# EAGLE design MainBoard (EAGLE 9.6.2)
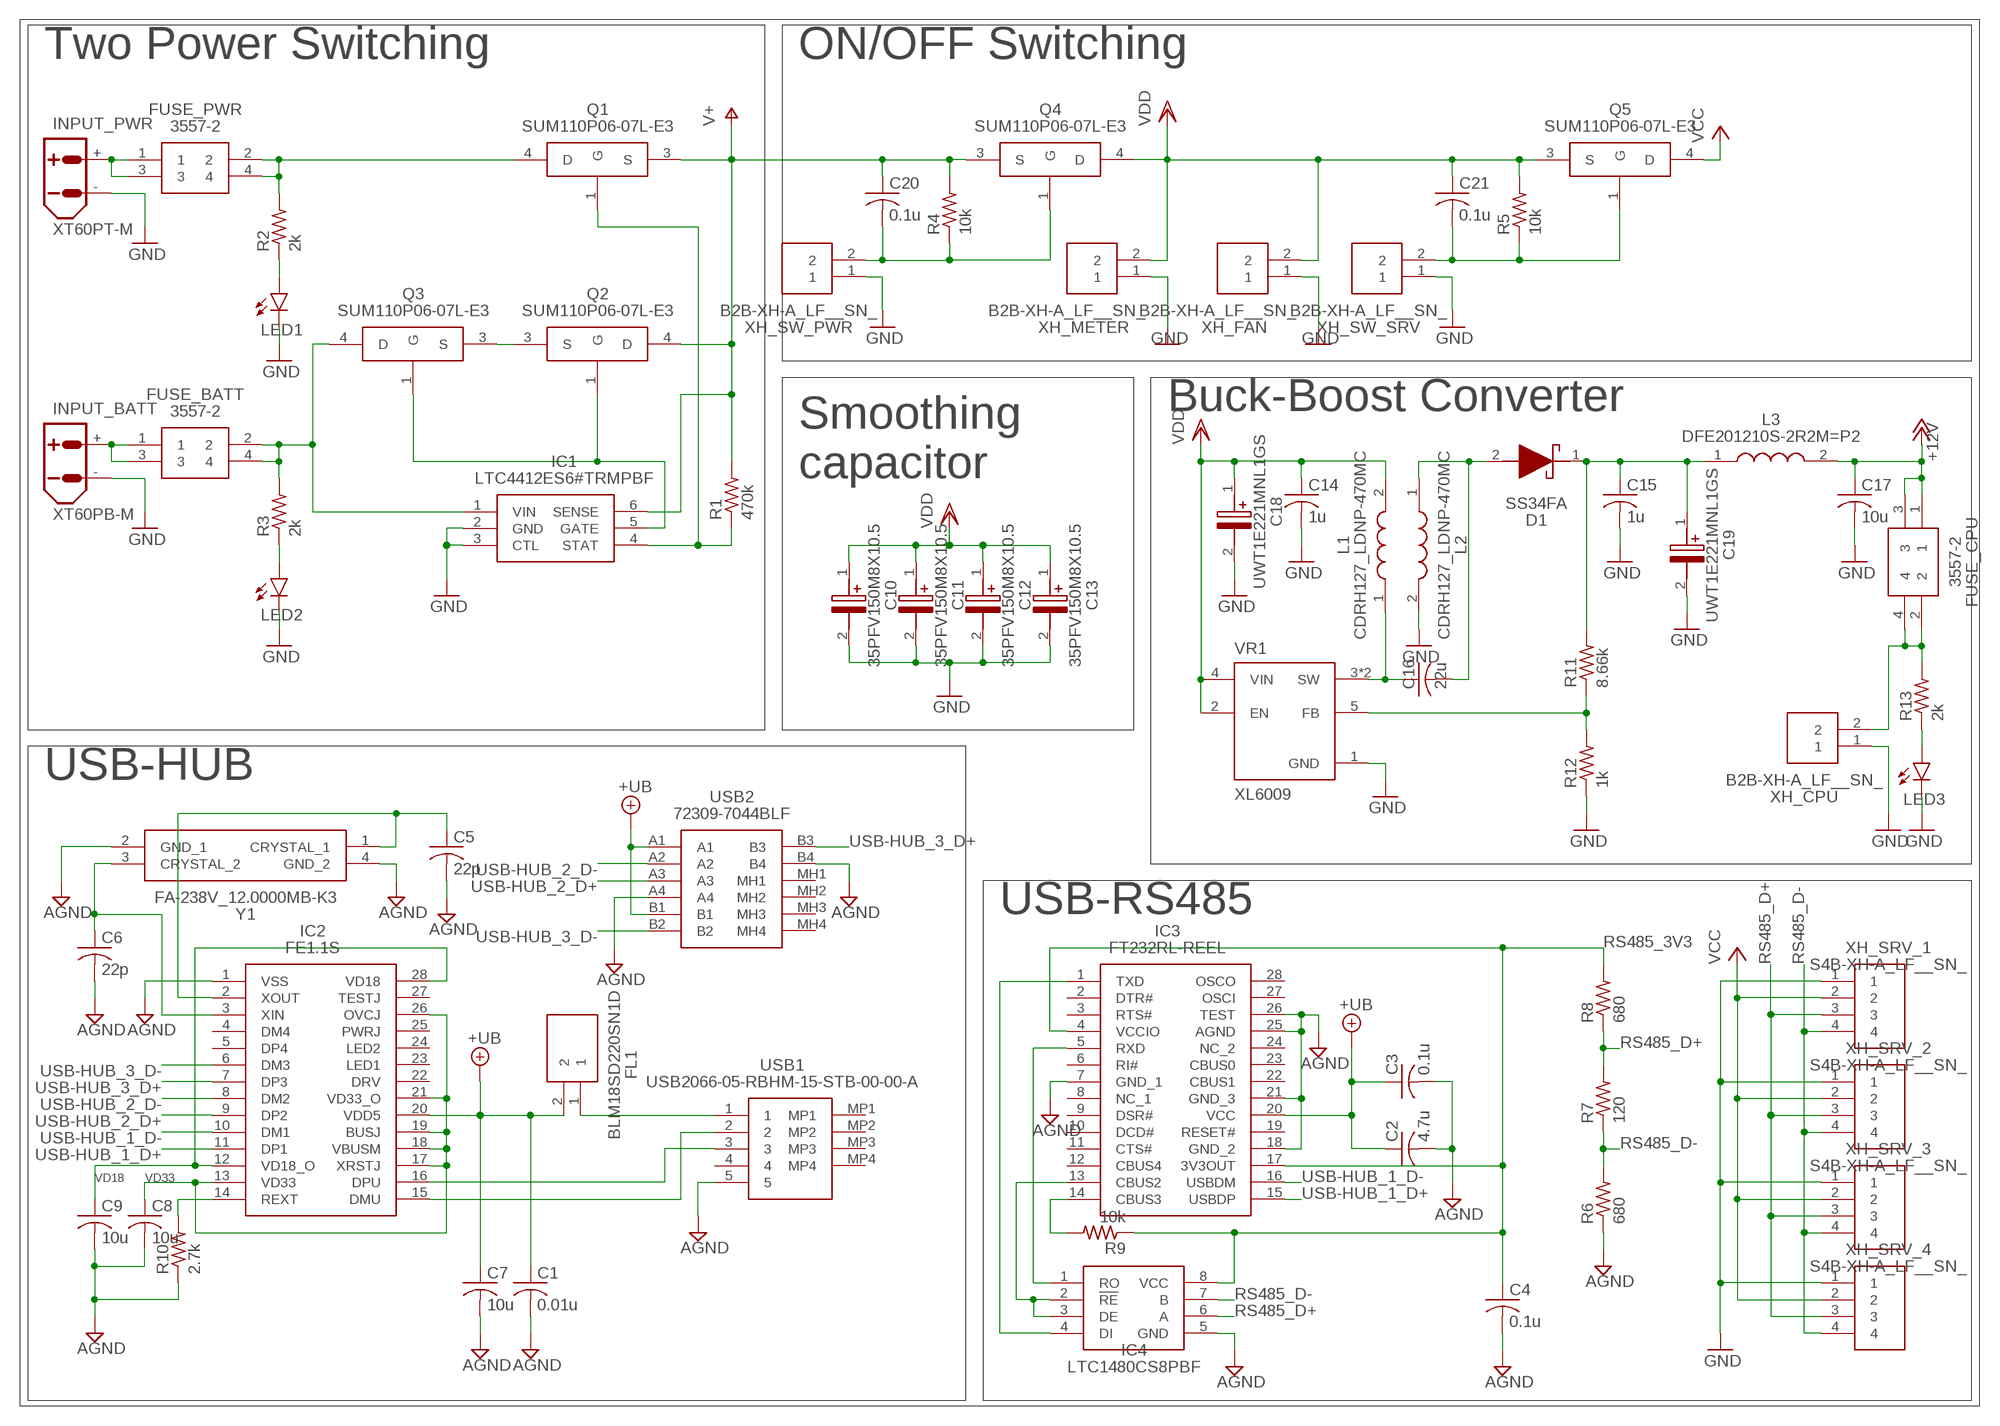
[diagram p0: schematic, sheet 1]

## Parts
C1  0.01u  C-USC1608  [C1608]
C2  4.7u  C-USC1608  [C1608]
C3  0.1u  C-USC1608  [C1608]
C4  0.1u  C-USC1608  [C1608]
C5  22p  C-USC1608  [C1608]
C6  22p  C-USC1608  [C1608]
C7  10u  C-USC1608  [C1608]
C8  10u  C-USC1608  [C1608]
C9  10u  C-USC1608  [C1608]
C10  35PFV150M8X10.5  [CAPAE830X1050N]
C11  35PFV150M8X10.5  [CAPAE830X1050N]
C12  35PFV150M8X10.5  [CAPAE830X1050N]
C13  35PFV150M8X10.5  [CAPAE830X1050N]
C14  1u  C-USC1608  [C1608]
C15  1u  C-USC1608  [C1608]
C16  22u  C-USC2012  [C2012]
C17  10u  C-USC1608  [C1608]
C18  UWT1E221MNL1GS  [CAPAE830X1080N]
C19  UWT1E221MNL1GS  [CAPAE830X1080N]
C20  0.1u  C-USC1608  [C1608]
C21  0.1u  C-USC1608  [C1608]
D1  SS34FA  [SODFL3618X143N]
FL1  BLM18SD220SN1D  [BLM18AG102BH1D]
FUSE_BATT  3557-2  [3557-2]
FUSE_CPU  3557-2  [3557-2]
FUSE_PWR  3557-2  [3557-2]
IC1  LTC4412ES6#TRMPBF  [SOT95P280X100-6N]
IC2  FE1.1S  [SOP64P600X175-28N]
IC3  FT232RL-REEL  [SOP65P778X200-28N]
IC4  LTC1480CS8PBF  [SOIC127P599X175-8N]
INPUT_BATT  XT60PB-M  [XT60PB-M]
INPUT_PWR  XT60PT-M  [XT60PT-M]
L1  CDRH127_LDNP-470MC  [INDPM120120X800N]
L2  CDRH127_LDNP-470MC  [INDPM120120X800N]
L3  DFE201210S-2R2M=P2  [DFE201210S1R0MP2]
LED1  LEDSML0603  [SML0603]
LED2  LEDSML0603  [SML0603]
LED3  LEDSML0603  [SML0603]
Q1  SUM110P06-07L-E3  [TO254P1524X483-4N]
Q2  SUM110P06-07L-E3  [TO254P1524X483-4N]
Q3  SUM110P06-07L-E3  [TO254P1524X483-4N]
Q4  SUM110P06-07L-E3  [TO254P1524X483-4N]
Q5  SUM110P06-07L-E3  [TO254P1524X483-4N]
R1  470k  R-US_R0603  [R0603]
R2  2k  R-US_R0603  [R0603]
R3  2k  R-US_R0603  [R0603]
R4  10k  R-US_R0603  [R0603]
R5  10k  R-US_R0603  [R0603]
R6  680  R-US_R0603  [R0603]
R7  120  R-US_R0603  [R0603]
R8  680  R-US_R0603  [R0603]
R9  10k  R-US_R0603  [R0603]
R10  2.7k  R-US_R0603  [R0603]
R11  8.66k  R-US_R0603  [R0603]
R12  1k  R-US_R0603  [R0603]
R13  2k  R-US_R0603  [R0603]
USB1  USB2066-05-RBHM-15-STB-00-00-A  [USB206605RBHM15STB0000A]
USB2  72309-7044BLF  [723097044BLF]
VR1  XL6009  [DPAK170P1435X465-6N]
XH_CPU  B2B-XH-A_LF__SN_  [SHDR2W64P0X250_1X2_740X575X700]
XH_FAN  B2B-XH-A_LF__SN_  [SHDR2W64P0X250_1X2_740X575X700]
XH_METER  B2B-XH-A_LF__SN_  [SHDR2W64P0X250_1X2_740X575X700]
XH_SRV_1  S4B-XH-A_LF__SN_  [SHDRRA4W64P0X250_1X4_1240X1150]
XH_SRV_2  S4B-XH-A_LF__SN_  [SHDRRA4W64P0X250_1X4_1240X1150]
XH_SRV_3  S4B-XH-A_LF__SN_  [SHDRRA4W64P0X250_1X4_1240X1150]
XH_SRV_4  S4B-XH-A_LF__SN_  [SHDRRA4W64P0X250_1X4_1240X1150]
XH_SW_PWR  B2B-XH-A_LF__SN_  [SHDR2W64P0X250_1X2_740X575X700]
XH_SW_SRV  B2B-XH-A_LF__SN_  [SHDR2W64P0X250_1X2_740X575X700]
Y1  FA-238V_12.0000MB-K3  [FA238V120000MBK3]

## Nets
+12V [DCDC_POWER]: C17.1 FUSE_CPU.1 FUSE_CPU.3 L3.2
+UB [USB_POWER]: C1.1 C2.1 C3.1 C7.1 FL1.2 IC2.20(VDD5) IC3.20(VCC) USB2.A1 USB2.B1
AFTER_FUSE_BATT [VCC]: FUSE_BATT.2 FUSE_BATT.4 IC1.1(VIN) Q3.4(D) R3.2
AFTER_FUSE_CPU [DCDC_POWER]: FUSE_CPU.2 FUSE_CPU.4 R13.2 XH_CPU.2
AFTER_FUSE_PWR [VCC]: FUSE_PWR.2 FUSE_PWR.4 Q1.4(D) R2.2
AGND [USB_POWER]: C1.2 C2.2 C3.2 C4.2 C5.2 C6.2 C7.2 C8.2 C9.2 IC2.1(VSS) IC3.7(GND_1) IC3.18(GND_2) IC3.21(GND_3) IC3.25(AGND) IC3.26(TEST) IC4.5(GND) R6.1 R10.1 USB1.5 USB2.A4 USB2.B4 Y1.2(GND_1) Y1.4(GND_2)
BEFORE_FUSE_BATT [VCC]: FUSE_BATT.1 FUSE_BATT.3 INPUT_BATT.+
BEFORE_FUSE_PWR [VCC]: FUSE_PWR.1 FUSE_PWR.3 INPUT_PWR.+
DCDC_1 [DCDC_POWER]: C16.1 L1.1 VR1.3(SW) VR1.6(SW)
DCDC_2 [DCDC_POWER]: C16.2 D1.2(A) L2.1
DCDC_3 [DCDC_POWER]: C15.1 C19.1(+) D1.1(K) L3.1 R11.2
DCDC_4 [DCDC_POWER]: R11.1 R12.2 VR1.5(FB)
FET_S_S [VCC]: Q2.3(S) Q3.3(S)
GND [GND]: C10.2(-) C11.2(-) C12.2(-) C13.2(-) C14.2 C15.2 C17.2 C18.2(-) C19.2(-) IC1.2(GND) IC1.3(CTL) INPUT_BATT.- INPUT_PWR.- L2.2 LED1.C LED2.C LED3.C R12.1 VR1.1(GND) XH_CPU.1 XH_FAN.1 XH_METER.1 XH_SRV_1.1 XH_SRV_2.1 XH_SRV_3.1 XH_SRV_4.1 XH_SW_PWR.1 XH_SW_SRV.1
LED1: LED1.A R2.1
LED2: LED2.A R3.1
LED3: LED3.A R13.1
N$1 [POWER_SW]: IC1.5(GATE) Q2.1(G) Q3.1(G)
N$2 [POWER_SW]: C20.2 Q4.1(G) R4.1 XH_SW_PWR.2
N$11 [POWER_SW]: C21.2 Q5.1(G) R5.1 XH_SW_SRV.2
N$21 [USB_SIGNAL]: C5.1 IC2.2(XOUT) Y1.1(CRYSTAL_1)
N$22 [USB_POWER]: FL1.1 USB1.1
N$23 [USB_SIGNAL]: C6.1 IC2.3(XIN) Y1.3(CRYSTAL_2)
N$29 [USB_SIGNAL]: IC2.15(DMU) USB1.2
N$30 [USB_SIGNAL]: IC2.16(DPU) USB1.3
N$31 [USB_SIGNAL]: IC2.14(REXT) R10.2
POWER_SW1 [POWER_SW]: IC1.4(STAT) Q1.1(G) R1.1
RS485_1 [USB_SIGNAL]: IC3.14(CBUS3) R9.2
RS485_2 [USB_SIGNAL]: IC3.13(CBUS2) IC4.2(!RE) IC4.3(DE)
RS485_3V3 [USB_POWER]: C4.1 IC3.4(VCCIO) IC3.17(3V3OUT) IC4.8(VCC) R8.2 R9.1
RS485_D+ [USB_SIGNAL]: IC4.6(A) R7.2 R8.1 XH_SRV_1.3 XH_SRV_2.3 XH_SRV_3.3 XH_SRV_4.3
RS485_D- [USB_SIGNAL]: IC4.7(B) R6.2 R7.1 XH_SRV_1.4 XH_SRV_2.4 XH_SRV_3.4 XH_SRV_4.4
RXD [USB_SIGNAL]: IC3.5(RXD) IC4.1(RO)
TXD [USB_SIGNAL]: IC3.1(TXD) IC4.4(DI)
USB-HUB_1_D+ [USB_SIGNAL]: IC2.11(DP1) IC3.15(USBDP)
USB-HUB_1_D- [USB_SIGNAL]: IC2.10(DM1) IC3.16(USBDM)
USB-HUB_2_D+ [USB_SIGNAL]: IC2.9(DP2) USB2.A3
USB-HUB_2_D- [USB_SIGNAL]: IC2.8(DM2) USB2.A2
USB-HUB_3_D+ [USB_SIGNAL]: IC2.7(DP3) USB2.B3
USB-HUB_3_D- [USB_SIGNAL]: IC2.6(DM3) USB2.B2
V+ [VCC]: C20.1 IC1.6(SENSE) Q1.3(S) Q2.4(D) Q4.3(S) R1.2 R4.2
VCC [VCC]: Q5.4(D) XH_SRV_1.2 XH_SRV_2.2 XH_SRV_3.2 XH_SRV_4.2
VD18 [USB_POWER]: C9.1 IC2.12(VD18_O) IC2.28(VD18)
VD33 [USB_POWER]: C8.1 IC2.13(VD33) IC2.17(XRSTJ) IC2.18(VBUSM) IC2.19(BUSJ) IC2.21(VD33_O) IC2.26(OVCJ)
VDD [VCC]: C10.1(+) C11.1(+) C12.1(+) C13.1(+) C14.1 C18.1(+) C21.1 L1.2 Q4.4(D) Q5.3(S) R5.2 VR1.2(EN) VR1.4(VIN) XH_FAN.2 XH_METER.2
Unconnected: IC2.4(DM4) IC2.5(DP4) IC2.22(DRV) IC2.23(LED1) IC2.24(LED2) IC2.25(PWRJ) IC2.27(TESTJ) IC3.2(DTR#) IC3.3(RTS#) IC3.6(RI#) IC3.8(NC_1) IC3.9(DSR#) IC3.10(DCD#) IC3.11(CTS#) IC3.12(CBUS4) IC3.19(RESET#) IC3.22(CBUS1) IC3.23(CBUS0) IC3.24(NC_2) IC3.27(OSCI) IC3.28(OSCO) USB1.4 USB1.MP1 USB1.MP2 USB1.MP3 USB1.MP4 USB2.MH1 USB2.MH2 USB2.MH3 USB2.MH4

## Notes on the sheet
- Two Power Switching | ON/OFF Switching
- Buck-Boost Converter
- Smoothing
  capacitor
- USB-HUB
- USB-RS485

## Library data of the parts
C1-C9 C14-C17 C20 C21 = rcl:C-US: CAPACITOR, American symbol; SPICEPREFIX: C
C10-C13 = SamacSys_Parts:35PFV150M8X10.5: Aluminium Organic Polymer Capacitors HIGH TEMP HYBRID CAPACITOR Source: Datasheet <https://www.mouser.jp/datasheet/2/977/e_PFV-1600672.pdf>; DESCRIPTION: Aluminium Organic Polymer Capacitors HIGH TEMP HYBRID CAPACITOR; HEIGHT: 10.5mm; MANUFACTURER_NAME: Rubycon; MANUFACTURER_PART_NUMBER: 35PFV150M8X10.5; MOUSER_PART_NUMBER: 232-35PFV150M8X10.5; MOUSER_PRICE-STOCK: https://www.mouser.co.uk/ProductDetail/Rubycon/35PFV150M8X105?qs=T3oQrply3y9NUlhGsXy%252Bsg%3D%3D
C18 C19 = SamacSys_Parts:UWT1E221MNL1GS: NICHICON - UWT1E221MNL1GS - ALUMINUM ELECTROLYTIC CAPACITOR 220UF 25V 20%, SMD Source: Datasheet <http://www.nichicon.co.jp/english/products/pdfs/e-uwt.pdf>; DESCRIPTION: NICHICON - UWT1E221MNL1GS - ALUMINUM ELECTROLYTIC CAPACITOR 220UF 25V 20%, SMD; HEIGHT: 10.8mm; MANUFACTURER_NAME: Nichicon; MANUFACTURER_PART_NUMBER: UWT1E221MNL1GS; MOUSER_PART_NUMBER: 647-UWT1E221MNL1GS; MOUSER_PRICE-STOCK: https://www.mouser.co.uk/ProductDetail/Nichicon/UWT1E221MNL1GS?qs=9nXXK2icEIxMJgFBHlqiZQ%3D%3D
D1 = SamacSys_Parts:SS34FA: ON SEMICONDUCTOR - SS34FA - SCHOTTKY RECT, AEC-Q101, 40V, SOD-123FA Source: Datasheet <http://www.onsemi.com/pub/Collateral/SS36FA-D.pdf>; DESCRIPTION: ON SEMICONDUCTOR - SS34FA - SCHOTTKY RECT, AEC-Q101, 40V, SOD-123FA; HEIGHT: 1.43mm; MANUFACTURER_NAME: ON Semiconductor; MANUFACTURER_PART_NUMBER: SS34FA; MOUSER_PART_NUMBER: 512-SS34FA; MOUSER_PRICE-STOCK: https://www.mouser.co.uk/ProductDetail/ON-Semiconductor-Fairchild/SS34FA?qs=R26iFe%2FkX%2FK1QUwZdCmBBw%3D%3D
FL1 = SamacSys_Parts:BLM18SD220SN1D: BLM18_N1D Series EMI Suppression Filter 22+/-25% at 100MHz 6A @85 Source: Datasheet <https://componentsearchengine.com/Datasheets/1/BLM18SD220SN1D.pdf>; DESCRIPTION: BLM18_N1D Series EMI Suppression Filter 22+/-25% at 100MHz 6A @85; HEIGHT: 0.95mm; MANUFACTURER_NAME: Murata Electronics; MANUFACTURER_PART_NUMBER: BLM18SD220SN1D; MOUSER_PART_NUMBER: 81-BLM18SD220SN1D; MOUSER_PRICE-STOCK: https://www.mouser.com/Search/Refine.aspx?Keyword=81-BLM18SD220SN1D
FUSE_BATT FUSE_CPU FUSE_PWR = SamacSys_Parts:3557-2: THM 2 in 1 Auto Blade Holder P/N 3557-2 Source: Datasheet <http://www.keyelco.com/product-pdf.cfm?p=296>; DESCRIPTION: THM 2 in 1 Auto Blade Holder P/N 3557-2; HEIGHT: mm; MANUFACTURER_NAME: Keystone Electronics; MANUFACTURER_PART_NUMBER: 3557-2; MOUSER_PART_NUMBER: 534-3557-2; MOUSER_PRICE-STOCK: https://www.mouser.co.uk/ProductDetail/Keystone-Electronics/3557-2?qs=cxy41lVAGV%2FfbyASjpXK1g%3D%3D
IC1 = SamacSys_Parts:LTC4412ES6#TRMPBF: Power Management Specialized - PMIC Automatic PowerPath Controller in ThinSOT Source: Datasheet; DESCRIPTION: Power Management Specialized - PMIC Automatic PowerPath Controller in ThinSOT; HEIGHT: 1mm; MANUFACTURER_NAME: Analog Devices; MANUFACTURER_PART_NUMBER: LTC4412ES6#TRMPBF; MOUSER_PART_NUMBER: 584-LTC4412ES6TRMPBF; MOUSER_PRICE-STOCK: https://www.mouser.co.uk/ProductDetail/Analog-Devices/LTC4412ES6TRMPBF?qs=hVkxg5c3xu8vBeVp9%252BXk%252Bg%3D%3D
IC2 = SamacSys_Parts:FE1.1S: USB 2.0 HIGH SPEED 4-PORT HUB CONTROLLER Source: Datasheet <https://cdn-shop.adafruit.com/product-files/2991/FE1.1s Data Sheet (Rev. 1.0).pdf>; DESCRIPTION: USB 2.0 HIGH SPEED 4-PORT HUB CONTROLLER; HEIGHT: 1.75mm; MANUFACTURER_NAME: JFD IC; MANUFACTURER_PART_NUMBER: FE1.1S
IC3 = SamacSys_Parts:FT232RL-REEL: USB/Serial IC UART SSOP-28 FTDI Chip FT232RL-REEL, USB Controller, 3MBd, USB 2.0, 1.8 5.25 V, 28-Pin SSOP Source: Datasheet <http://www.ftdichip.com/Support/Documents/DataSheets/ICs/DS_FT232R.pdf>; DESCRIPTION: USB/Serial IC UART SSOP-28 FTDI Chip FT232RL-REEL, USB Controller, 3MBd, USB 2.0, 1.8 5.25 V, 28-Pin SSOP; HEIGHT: 2mm; MANUFACTURER_NAME: FTDI Chip; MANUFACTURER_PART_NUMBER: FT232RL-REEL; MOUSER_PART_NUMBER: 895-FT232RL; MOUSER_PRICE-STOCK: https://www.mouser.co.uk/ProductDetail/FTDI/FT232RL-REEL?qs=D1%2FPMqvA103RC6OU6bKtoA%3D%3D
IC4 = SamacSys_Parts:LTC1480CS8PBF: 3.3V Ultralow Power RS485 Transceiver Source: Datasheet <https://www.analog.com/media/en/technical-documentation/data-sheets/1480fa.pdf>; DESCRIPTION: 3.3V Ultralow Power RS485 Transceiver; HEIGHT: 1.752mm; MANUFACTURER_NAME: Linear Technology; MANUFACTURER_PART_NUMBER: LTC1480CS8PBF
INPUT_BATT INPUT_PWR = amass:XT60: AMASS XT60 connector Store in Japan AMASS XT60 connector <https://szc.jp/ams-xt60>
L1 L2 = SamacSys_Parts:CDRH127_LDNP-470MC: Fixed Inductors 47uH 3.25A Source: Datasheet <https://products.sumida.com/products/pdf/CDRH127LD.pdf>; DESCRIPTION: Fixed Inductors 47uH 3.25A; HEIGHT: 8mm; MANUFACTURER_NAME: Sumida; MANUFACTURER_PART_NUMBER: CDRH127/LDNP-470MC; MOUSER_PART_NUMBER: 851-CDRH127LDNP470MC; MOUSER_PRICE-STOCK: https://www.mouser.co.uk/ProductDetail/Sumida/CDRH127-LDNP-470MC?qs=DrDMc5cg91OBCptfPhw%252Bdw%3D%3D
L3 = SamacSys_Parts:DFE201210S-2R2M=P2: DFE201210S Series Inductor 2.2uH +/-20% 0805 (2012) Source: Datasheet <https://psearch.en.murata.com/inductor/product/DFE201210S-2R2M#.html>; DESCRIPTION: DFE201210S Series Inductor 2.2uH +/-20% 0805 (2012); HEIGHT: 1mm; MANUFACTURER_NAME: Murata Electronics; MANUFACTURER_PART_NUMBER: DFE201210S-2R2M=P2; MOUSER_PART_NUMBER: 81-DFE201210S-2R2MP2; MOUSER_PRICE-STOCK: https://www.mouser.co.uk/ProductDetail/Murata-Electronics/DFE201210S-2R2M%3dP2?qs=AQlKX63v8RsffUVc8Yv8PQ%3D%3D
LED1-LED3 = led:LED: LED OSRAM: - CHIPLED LG R971, LG N971, LY N971, LG Q971, LY Q971, LO R971, LY R971 LH N974, LH R974 LS Q976, LO Q976, LY Q976 LO Q996 - Hyper CHIPLED LW Q18S LB Q993, LB Q99A, LB R99A - SideLED LS A670, LO A670, LY A670, LG A670, LP A670 LB A673, LV A673, LT A673, LW A673 LH A674 LY A675 LS A676, LA A676, LO A676, LY A676, LW A676 LS A679, LY A679, LG A679 - Hyper Micro SIDELED® LS Y876, LA Y876, LO Y876, LY Y876 LT Y87S - SmartLED LW L88C, LW L88S LB L89C, LB L89S, LG L890 LS L89K, LO L89K, LY L89K LS L896, LA L896, LO L896, LY L896 - TOPLED LS T670, LO T670, LY T670, LG T670, LP T670 LSG T670, LSP T670, LSY T670, LOP T670, LYG T670 LG T671, LOG T671, LSG T671 LB T673, LV T673, LT T673, LW T673 LH T674 LS T676, LA T676, LO T676, LY T676, LB T676, LH T676, LSB T676, LW T676 LB T67C, LV T67C, LT T67C, LS T67K, LO T67K, LY T67K, LW E67C LS E67B, LA E67B, LO E67B, LY E67B, LB E67C, LV E67C, LT E67C LW T67C LS T679, LY T679, LG T679 LS T770, LO T770, LY T770, LG T770, LP T770 LB T773, LV T773, LT T773, LW T773 LH T774 LS E675, LA E675, LY E675, LS T675 LS T776, LA T776, LO T776, LY T776, LB T776 LHGB T686 LT T68C, LB T68C - Hyper Mini TOPLED® LB M676 - Mini TOPLED Santana® LG M470 LS M47K, LO M47K, LY M47K Source: http://www.osram.convergy.de LUXEON: - LUMILED® LXK2-PW12-R00, LXK2-PW12-S00, LXK2-PW14-U00, LXK2-PW14-V00 LXK2-PM12-R00, LXK2-PM12-S00, LXK2-PM14-U00 LXK2-PE12-Q00, LXK2-PE12-R00, LXK2-PE12-S00, LXK2-PE14-T00, LXK2-PE14-U00 LXK2-PB12-K00, LXK2-PB12-L00, LXK2-PB12-M00, LXK2-PB14-N00, LXK2-PB14-P00, LXK2-PB14-Q00 LXK2-PR12-L00, LXK2-PR12-M00, LXK2-PR14-Q00, LXK2-PR14-R00 LXK2-PD12-Q00, LXK2-PD12-R00, LXK2-PD12-S00 LXK2-PH12-R00, LXK2-PH12-S00 LXK2-PL12-P00, LXK2-PL12-Q00, LXK2-PL12-R00 Source: www.luxeon.com KINGBRIGHT: KA-3528ASYC Source: www.kingbright.com
Q1-Q5 = SamacSys_Parts:SUM110P06-07L-E3: Trans MOSFET P-CH 60V 110A TO-263 Source: Datasheet <http://www.vishay.com/docs/72439/sum110p06-07l.pdf>; DESCRIPTION: Trans MOSFET P-CH 60V 110A TO-263; HEIGHT: 4.826mm; MANUFACTURER_NAME: Vishay; MANUFACTURER_PART_NUMBER: SUM110P06-07L-E3; MOUSER_PART_NUMBER: 781-SUM110P06-07L-E3; MOUSER_PRICE-STOCK: https://www.mouser.co.uk/ProductDetail/Vishay-Semiconductors/SUM110P06-07L-E3?qs=xrZAeqbNnhhCq86%252BSoA9ZA%3D%3D
R1-R13 = rcl:R-US_: RESISTOR, American symbol; SPICEPREFIX: R
USB1 = SamacSys_Parts:USB2066-05-RBHM-15-STB-00-00-A: GCT (GLOBAL CONNECTOR TECHNOLOGY) - USB2066-05-RBHM-15-STB-00-00-A - USB Connector, Mini USB Type B, USB 2.0, Receptacle, 5 Positions, Surface Mount, Right Angle Source: Datasheet; DESCRIPTION: GCT (GLOBAL CONNECTOR TECHNOLOGY) - USB2066-05-RBHM-15-STB-00-00-A - USB Connector, Mini USB Type B, USB 2.0, Receptacle, 5 Positions, Surface Mount, Right Angle; HEIGHT: 4.25mm; MANUFACTURER_NAME: GCT (GLOBAL CONNECTOR TECHNOLOGY); MANUFACTURER_PART_NUMBER: USB2066-05-RBHM-15-STB-00-00-A; MOUSER_PART_NUMBER: 640-2665RBHM15STB00A; MOUSER_PRICE-STOCK: https://www.mouser.co.uk/ProductDetail/GCT/USB2066-05-RBHM-15-STB-00-00-A?qs=KUoIvG%2F9IlZEo87a0wQR%252BA%3D%3D
USB2 = SamacSys_Parts:72309-7044BLF: USB 2.0, Input Output Connectors, Double Deck Receptacle, Type A, Through Hole, Right Angle, 8 Positions Source: Datasheet <http://www.amphenol-icc.com/media/wysiwyg/files/drawing/72309.pdf>; DESCRIPTION: USB 2.0, Input Output Connectors, Double Deck Receptacle, Type A, Through Hole, Right Angle, 8 Positions; HEIGHT: 15.8mm; MANUFACTURER_NAME: Amphenol; MANUFACTURER_PART_NUMBER: 72309-7044BLF
VR1 = XL6009:XL6009: The XL6009 regulator is a wide input range, current mode, DC/DC converter which is capable of generating either positive or negative output voltages. Check prices <https://pricing.snapeda.com/parts/XL6009/XLSEMI/view-part?ref=eda>; AVAILABILITY: No availability data; DESCRIPTION: The XL6009 regulator is a wide input range, current mode, DC/DC converter which is capable of generating either positive or negative output voltages.; MF: XLSEMI; MP: XL6009; PACKAGE: TO-263-5L XLSEMI; PRICE: None
XH_CPU XH_FAN XH_METER XH_SW_PWR XH_SW_SRV = SamacSys_Parts:B2B-XH-A_LF__SN_: Connector Header Through Hole 2 position 0.098" (2.50mm) Source: Datasheet <http://www.jst-mfg.com/product/pdf/eng/eXH.pdf>; DESCRIPTION: Connector Header Through Hole 2 position 0.098" (2.50mm); HEIGHT: 7mm; MANUFACTURER_NAME: JST (JAPAN SOLDERLESS TERMINALS); MANUFACTURER_PART_NUMBER: B2B-XH-A(LF)(SN)
XH_SRV_1-XH_SRV_4 = SamacSys_Parts:S4B-XH-A_LF__SN_: XH-2.5mm Header side entry 4 way JST XH Series, Series Number S4B, 2.5mm Pitch 4 Way 1 Row Right Angle PCB Header, Solder Termination, 3A Source: Datasheet <http://www.jst-mfg.com/product/pdf/eng/eXH.pdf>; DESCRIPTION: XH-2.5mm Header side entry 4 way JST XH Series, Series Number S4B, 2.5mm Pitch 4 Way 1 Row Right Angle PCB Header, Solder Termination, 3A; HEIGHT: 7mm; MANUFACTURER_NAME: JST (JAPAN SOLDERLESS TERMINALS); MANUFACTURER_PART_NUMBER: S4B-XH-A(LF)(SN)
Y1 = SamacSys_Parts:FA-238V_12.0000MB-K3: Crystals 12.0000MHz 50ppm 10pF -40C +85C Source: Datasheet <https://support.epson.biz/td/api/doc_check.php?dl=brief_FA-238V&lang=en>; DESCRIPTION: Crystals 12.0000MHz 50ppm 10pF -40C +85C; HEIGHT: 0.7mm; MANUFACTURER_NAME: Epson Timing; MANUFACTURER_PART_NUMBER: FA-238V 12.0000MB-K3; MOUSER_PART_NUMBER: 732-FA238V12.B-K3; MOUSER_PRICE-STOCK: https://www.mouser.co.uk/ProductDetail/Epson-Timing/FA-238V-120000MB-K3/?qs=6J2kD0vu%2F2URNf%252BvkglO1g%3D%3D

## Net classes
0 default: width 0.254 mm, drill 0.127 mm, clearance 0.203 mm
1 VCC: width 1.778 mm, drill 0.889 mm, clearance 0.203 mm
2 USB_POWER: width 0.254 mm, drill 0.127 mm, clearance 0.203 mm
3 DCDC_POWER: width 1.143 mm, drill 0.635 mm, clearance 0.203 mm
4 GND: width 1.27 mm, drill 0.635 mm, clearance 0.203 mm
5 USB_SIGNAL: width 0.254 mm, drill 0.127 mm, clearance 0.203 mm
6 POWER_SW: width 0.508 mm, drill 0.127 mm, clearance 0.203 mm

## Board
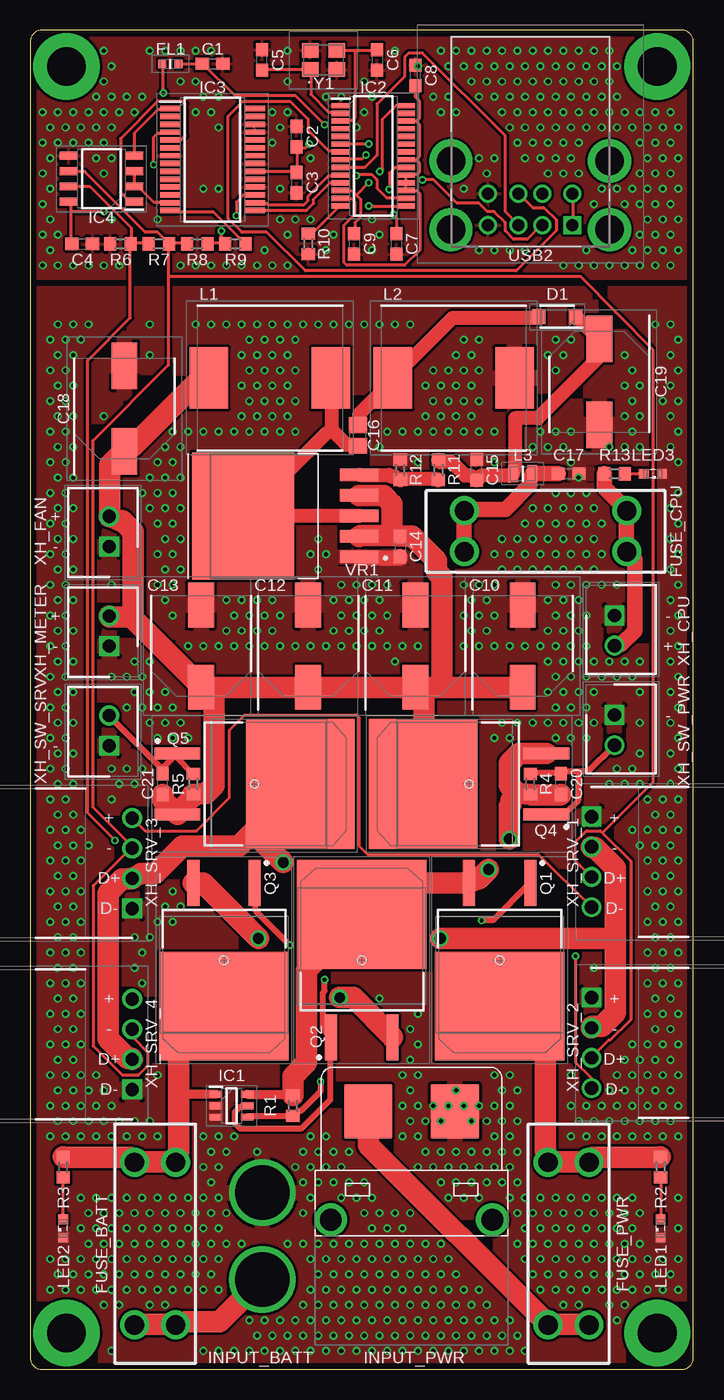
[diagram p1: board, top side]
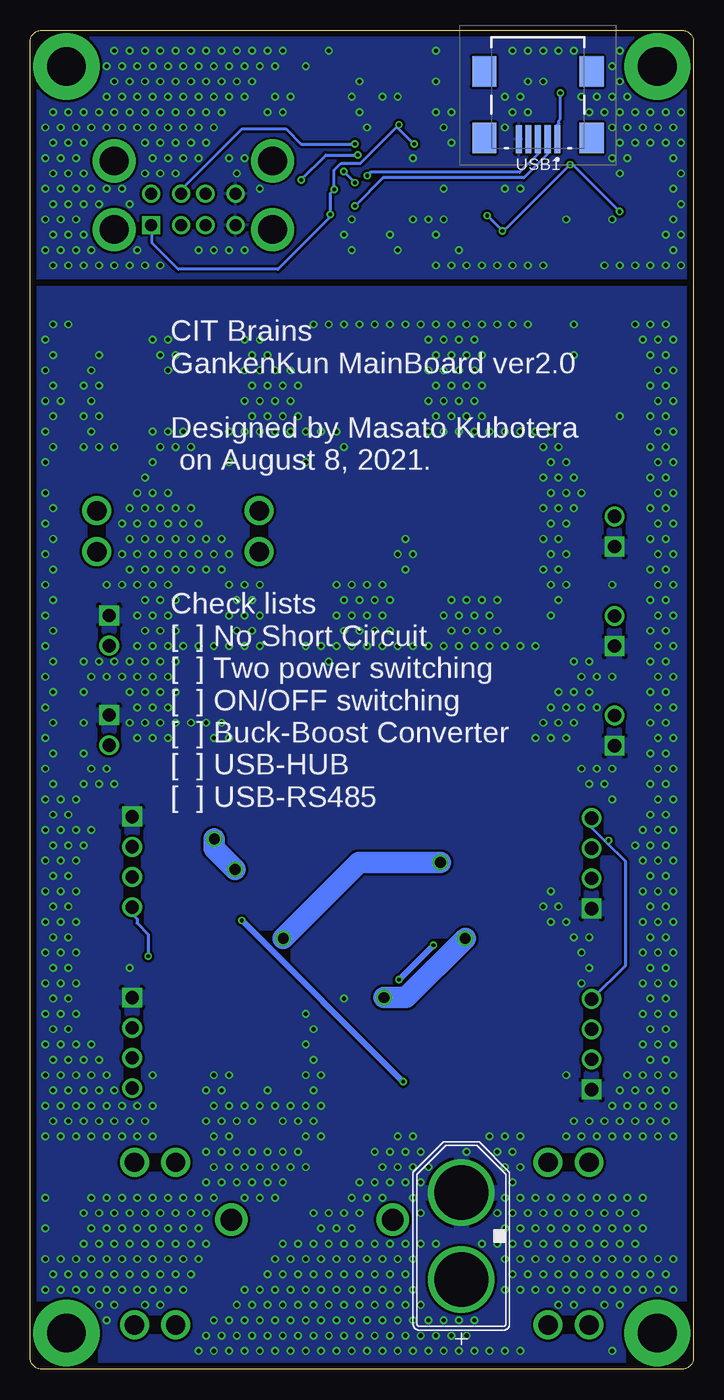
[diagram p2: board, bottom side, seen from below]

Size 55 x 111 mm. Coordinates in mm from the lower left corner, seen from the top.
Outline: 1,111 arc90 0,110 0,1 arc90 1,0 54,0 arc90 55,1 55,110 arc90 54,111 1,111
Copper layers (1*16): Top 0.035mm / dielectric 1.6mm / Bottom 0.035mm
Design rules "Elecrow_2-layer_PCB_eagle_rule *": minimum track width 6mil, minimum drill 12mil, track to track 6mil, track to pad 6mil, pad to pad 6mil, via to via 8mil, smd to smd 0mil, copper to edge 20mil, drill to drill 10mil, minimum pad ring 6mil, minimum via ring 6mil, stop-mask expansion 0mil, vias tented up to drill 100mil, thermal gap 10mil

### Footprints (pad centres in the part's own frame; a part is rotated, then mirrored left to right if it is on the bottom)
C1608 = smd 1.1 x 1: 1 -0.85,0; 2 0.85,0
CAPAE830X1050N = smd 3.7 x 2.15: 1 -3.4,0; 2 3.4,0
C2012 = smd 1.3 x 1.5: 1 -0.85,0; 2 0.85,0
CAPAE830X1080N = smd 3.85 x 2.15: 1 -3.55,0; 2 3.55,0
SODFL3618X143N = smd 1.12 x 1.22: 1 -1.55,0; 2 1.55,0
BLM18AG102BH1D = smd 0.65 x 0.7: 1 -0.675,0; 2 0.675,0
3557-2 = drill 1.6 pad 2.4: 1 -6.735,1.7; 2 6.735,1.7; 3 -6.735,-1.7; 4 6.735,-1.7
SOT95P280X100-6N = smd 1.05 x 0.55: 1 -1.3,0.95; 2 -1.3,0; 3 -1.3,-0.95; 4 1.3,-0.95; 5 1.3,0; 6 1.3,0.95
SOP64P600X175-28N = smd 1.525 x 0.44: 1 -2.712,4.16; 2 -2.712,3.52; 3 -2.712,2.88; 4 -2.712,2.24; 5 -2.712,1.6; 6 -2.712,0.96; 7 -2.712,0.32; 8 -2.712,-0.32; 9 -2.712,-0.96; 10 -2.712,-1.6; 11 -2.712,-2.24; 12 -2.712,-2.88; 13 -2.712,-3.52; 14 -2.712,-4.16; 15 2.712,-4.16; 16 2.712,-3.52; 17 2.712,-2.88; 18 2.712,-2.24; 19 2.712,-1.6; 20 2.712,-0.96; 21 2.712,-0.32; 22 2.712,0.32; 23 2.712,0.96; 24 2.712,1.6; 25 2.712,2.24; 26 2.712,2.88; 27 2.712,3.52; 28 2.712,4.16
SOP65P778X200-28N = smd 1.7 x 0.45: 1 -3.5,4.225; 2 -3.5,3.575; 3 -3.5,2.925; 4 -3.5,2.275; 5 -3.5,1.625; 6 -3.5,0.975; 7 -3.5,0.325; 8 -3.5,-0.325; 9 -3.5,-0.975; 10 -3.5,-1.625; 11 -3.5,-2.275; 12 -3.5,-2.925; 13 -3.5,-3.575; 14 -3.5,-4.225; 15 3.5,-4.225; 16 3.5,-3.575; 17 3.5,-2.925; 18 3.5,-2.275; 19 3.5,-1.625; 20 3.5,-0.975; 21 3.5,-0.325; 22 3.5,0.325; 23 3.5,0.975; 24 3.5,1.625; 25 3.5,2.275; 26 3.5,2.925; 27 3.5,3.575; 28 3.5,4.225
SOIC127P599X175-8N = smd 1.526 x 0.65: 1 -2.712,1.905; 2 -2.712,0.635; 3 -2.712,-0.635; 4 -2.712,-1.905; 5 2.712,-1.905; 6 2.712,-0.635; 7 2.712,0.635; 8 2.712,1.905
XT60PB-M = drill 4.5: + 3.6,0; - -3.6,0
XT60PT-M = smd 4 x 4.5: + 3.6,-10.35; - -3.6,-10.35 | drill 1.8: P$3 -6.7,-1.35; P$4 6.7,-1.35
INDPM120120X800N = smd 3.2 x 5.1: 1 -5.05,0; 2 5.05,0
DFE201210S1R0MP2 = smd 0.8 x 1.4: 1 -0.8,0; 2 0.8,0
SML0603 = smd 0.8 x 0.8: A 0.75,0; C -0.75,0
TO254P1524X483-4N = smd 3.8 x 1: 1 -6.4,2.54; 3 -6.4,-2.54 | smd 9 x 10.75: 4 3.8,0
R0603 = smd 1 x 1.1: 1 -0.85,0; 2 0.85,0
USB206605RBHM15STB0000A = smd 0.5 x 2.3: 1 -1.6,5.6; 2 -0.8,5.6; 3 0,5.6; 4 0.8,5.6; 5 1.6,5.6 | smd 2 x 2.5: MP1 -4.45,5.5; MP2 4.45,5.5; MP3 4.45,0; MP4 -4.45,0
723097044BLF = drill 1 pad 1.5 square: A1 -3.5,1.31 | drill 1 pad 1.5: A2 -1,1.31; A3 1,1.31; A4 3.5,1.31; B1 -3.5,-1.31; B2 -1,-1.31; B3 1,-1.31; B4 3.5,-1.31 | drill 2.38 pad 3.57: MH1 -6.57,1.66; MH2 -6.57,-4.02; MH3 6.57,-4.02; MH4 6.57,1.66
DPAK170P1435X465-6N = smd 3.21 x 1.05: 1 -6.13,3.4; 2 -6.13,1.7; 3 -6.13,0; 4 -6.13,-1.7; 5 -6.13,-3.4 | smd 8.46 x 10.53: 6 3.5,0
SHDR2W64P0X250_1X2_740X575X700 = drill 1.1 pad 1.65 square: 1 -1.27,0 | drill 1.1 pad 1.65: 2 1.23,0
SHDRRA4W64P0X250_1X4_1240X1150 = drill 1.1 pad 1.65 square: 1 -3.81,0 | drill 1.1 pad 1.65: 2 -1.31,0; 3 1.19,0; 4 3.69,0
FA238V120000MBK3 = smd 1.4 x 1.2: 1 -1.1,-0.8; 2 1.1,-0.8; 3 1.1,0.8; 4 -1.1,0.8

### Placement (x,y rotation side)
C1  15.12,108.2 0 top
C2  22.1,102.17 90 top
C3  22.1,98.36 270 top
C4  4.32,93.28 0 top
C5  19.24,108.52 90 top
C6  28.77,108.52 270 top
C7  30.36,93.28 270 top
C8  31.95,107.25 90 top
C9  26.86,93.28 270 top
C10  40.84,59.95 90 top
C11  31.95,59.95 90 top
C12  23.05,59.95 90 top
C13  14.16,59.95 90 top
C14  30.68,68.2 270 top
C15  37.02,74.55 90 top
C16  27.18,77.41 90 top
C17  44.64,74.23 0 top
C18  7.82,79.63 90 top
C19  47.19,81.85 270 top
C20  44.01,48.52 90 top
C21  10.99,48.52 90 top
D1  43.69,87.25 180 top
FL1  11.62,108.2 0 top
FUSE_BATT  10.36,10.41 90 top
FUSE_CPU  42.74,69.47 0 top
FUSE_PWR  44.64,10.41 90 top
IC1  16.7,21.84 0 top
IC2  28.45,100.59 0 top
IC3  15.12,100.27 0 top
IC4  5.91,98.68 180 top
INPUT_BATT  19.24,11.05 270 bottom
INPUT_PWR  31.63,11.05 180 top
L1  19.88,82.17 180 top
L2  35.12,82.17 0 top
L3  40.84,74.23 0 top
LED1  52.27,11.69 90 top
LED2  2.73,11.69 90 top
LED3  51.63,74.23 180 top
Q1  38.93,33.91 270 top
Q2  27.5,33.91 90 top
Q3  16.07,33.91 270 top
Q4  36.39,48.52 180 top
Q5  18.61,48.52 0 top
R1  21.79,21.84 90 top
R2  52.27,16.77 90 top
R3  2.73,16.77 90 top
R4  41.47,48.52 270 top
R5  13.53,48.52 270 top
R6  7.5,93.28 0 top
R7  10.67,93.28 0 top
R8  13.85,93.28 0 top
R9  17.02,93.28 0 top
R10  23.05,93.28 90 top
R11  33.85,74.55 90 top
R12  30.68,74.55 270 top
R13  48.45,74.23 180 top
USB1  12.89,107.57 180 bottom
USB2  41.47,96.14 180 top
VR1  21.15,70.74 180 top
XH_CPU  48.45,61.22 270 top
XH_FAN  6.55,69.47 90 top
XH_METER  6.55,61.22 90 top
XH_SRV_1  46.55,42 270 top
XH_SRV_2  46.55,27 270 top
XH_SRV_3  8.45,42 90 top
XH_SRV_4  8.45,27 90 top
XH_SW_PWR  48.45,52.96 270 top
XH_SW_SRV  6.55,52.96 90 top
Y1  24.32,108.52 0 top

### Tracks (layer width: path | path; a pad name or v marks a point on that pad's centre or on a via)
+12V
  Top 1.27: C17.1 43.73,74.25 41.67,74.25 L3.2 41.45,73.67 41.45,73.33 39.39,71.27 36.07,71.27 FUSE_CPU.1 35.96,70.59 35.96,67.84 FUSE_CPU.3
+UB  (via drill 0.3)
  Top 0.254: USB2.A1 44.99,94.93 44.99,97.45 USB2.B1 | IC3.20 18.7,99.28 22.01,99.28 C3.1 22.13,99.28 22.13,101.22 C2.1 22.24,101.22 22.81,101.22 v23.16,101.56 | FL1.2 12.41,108.19 14.24,108.19 C1.1 14.36,108.19 16.98,105.56 22.01,105.56 v24.41,103.16 | C7.1 30.36,95.5 v30.13,95.73 | v29.79,97.79 29.79,99.16 30.24,99.62 IC2.20
  Bottom 0.254: v23.16,101.56 24.53,102.93 v24.41,103.16 27.61,99.96 29.21,99.96 29.79,99.39 v29.79,97.79 30.13,97.45 v30.13,95.73 30.13,95.5 34.46,91.17 42.72,91.17 44.87,93.33 44.87,94.82 USB2.A1
AFTER_FUSE_BATT
  Top 0.762: IC1.1 12.3,22.8
  Top 1.778: R3.2 2.81,17.55 8.3,17.55 8.64,17.21 FUSE_BATT.2 9.55,17.21 11.96,17.21 FUSE_BATT.4 12.3,18.01 12.3,22.48 12.3,22.8 12.3,26.24 16.07,30.01 Q3.4
AFTER_FUSE_CPU
  Top 1.27: R13.2 47.62,74.13 47.62,73.1 49.45,71.27 FUSE_CPU.2 49.45,70.59 49.45,68.3 FUSE_CPU.4 49.56,67.73 50.13,67.16 50.13,61.22 48.99,60.07 48.53,60.07 XH_CPU.2
AFTER_FUSE_PWR
  Top 1.778: R2.2 52.19,17.55 46.7,17.55 46.36,17.21 FUSE_PWR.4 45.45,17.21 43.05,17.21 FUSE_PWR.2 42.7,18.01 42.7,26.24 38.93,30.01 Q1.4
AGND  (via drill 0.35)
  other vias: 1.03,91.5 1.03,94.04 1.03,96.58 1.03,99.12 1.03,101.66 1.03,104.2 2.3,91.5 1.66,92.77 2.3,94.04 1.66,95.31 1.66,97.85 1.66,100.39 2.3,101.66 1.66,102.93 2.3,104.2 3.57,91.5 3.57,101.66 2.93,102.93 3.57,104.2 4.84,91.5 4.84,101.66 4.2,102.93 4.84,104.2 6.11,91.5 6.11,99.12 5.48,100.39 6.11,101.66 5.48,102.93 6.11,104.2 5.48,105.47 6.11,106.74 6.11,109.28 7.38,91.5 6.75,95.31 6.75,100.39 6.75,102.93 7.38,104.2 6.75,105.47 6.75,108.01 8.65,104.2 8.02,105.47 9.29,105.47 9.92,109.28 10.55,95.31 11.19,109.28 12.46,91.5 12.46,106.74 12.46,109.28 13.73,91.5 13.73,104.2 13.73,106.74 13.73,109.28 15,91.5 14.37,97.85 15,104.2 14.37,105.47 15,109.28 16.27,91.5 15.63,97.85 15.63,102.93 15.63,105.47 17.54,91.5 18.81,91.5 20.08,91.5 19.45,92.77 20.08,101.66 20.08,104.2 21.35,91.5 21.35,94.04 20.71,95.31 20.71,97.85 20.71,102.93 21.35,104.2 21.35,106.74 21.35,109.28 21.98,95.31 23.25,95.31 24.52,92.77 25.16,94.04 24.52,105.47 25.8,105.47 27.07,102.93 27.7,104.2 27.7,106.74 28.34,92.77 28.97,94.04 28.34,95.31 28.34,105.47 30.24,109.28 32.14,108.01 34.05,104.2 33.41,105.47 34.05,109.28 35.32,104.2 34.69,105.47 34.69,108.01 35.32,109.28 35.95,97.85 36.59,106.74 35.95,108.01 36.59,109.28 37.23,92.77 37.86,99.12 37.23,100.39 37.23,105.47 37.86,106.74 37.23,108.01 37.86,109.28 38.49,92.77 38.49,100.39 39.13,104.2 38.49,105.47 39.13,106.74 38.49,108.01 39.13,109.28 39.77,92.77 40.4,101.66 39.77,102.93 40.4,104.2 39.77,105.47 40.4,106.74 39.77,108.01 40.4,109.28 41.03,92.77 41.03,100.39 41.67,101.66 41.03,102.93 41.67,104.2 41.03,105.47 41.67,106.74 41.03,108.01 41.67,109.28 42.94,99.12 42.3,100.39 42.94,101.66 42.3,102.93 42.94,104.2 42.3,105.47 42.94,106.74 42.3,108.01 42.94,109.28 44.21,91.5 44.21,99.12 43.58,100.39 44.21,101.66 43.58,102.93 44.21,104.2 43.58,105.47 44.21,106.74 43.58,108.01 44.21,109.28 45.48,91.5 45.48,99.12 44.84,100.39 45.48,101.66 44.84,102.93 45.48,104.2 44.84,105.47 45.48,106.74 44.84,108.01 45.48,109.28 46.75,91.5 46.11,92.77 46.75,96.58 46.11,102.93 46.75,104.2 46.11,105.47 46.75,106.74 46.11,108.01 46.75,109.28 48.02,91.5 47.39,97.85 47.39,102.93 48.02,104.2 47.39,105.47 48.02,106.74 47.39,108.01 48.02,109.28 49.29,91.5 49.29,96.58 48.66,97.85 48.66,102.93 49.29,104.2 48.66,105.47 48.66,108.01 50.56,91.5 49.92,92.77 50.56,94.04 50.56,96.58 49.92,97.85 50.56,99.12 50.56,101.66 49.92,102.93 50.56,104.2 51.83,91.5 51.2,92.77 51.83,94.04 51.2,95.31 51.83,96.58 51.2,97.85 51.83,99.12 51.2,100.39 51.83,101.66 51.2,102.93 51.83,104.2 53.1,91.5 52.47,92.77 53.1,94.04 52.47,95.31 53.1,96.58 52.47,97.85 53.1,99.12 52.47,100.39 53.1,101.66 52.47,102.93 53.1,104.2 53.73,92.77 53.73,95.31 53.73,97.85 53.73,100.39 53.73,102.93 23.25,100.39
  pour Top: -0.44,111.38 -0.44,90.42 55.44,90.42 55.44,111.38
  pour Bottom: -0.44,111.38 -0.44,90.42 55.44,90.42 55.44,111.38
BEFORE_FUSE_BATT
  Top 1.778: FUSE_BATT.1 8.75,3.72 11.96,3.72 FUSE_BATT.3 12.87,3.95 15.73,3.95 19.16,7.38 INPUT_BATT.+
BEFORE_FUSE_PWR
  Top 1.778: INPUT_PWR.+ 28.07,21.32 28.07,18.58 42.93,3.72 FUSE_PWR.1 43.73,3.72 46.25,3.72 FUSE_PWR.3
DCDC_1
  Top 1.143: 24.98,77.9 26.24,76.64 27.16,76.64 C16.1 | 24.98,77.9 24.98,82.13 L1.1 | 24.98,77.9 24.53,77.56 17.67,70.7 VR1.6 | VR1.3 18.45,70.74 VR1.6 | VR1.6 17.34,70.74
DCDC_2
  Top 1.143: D1.2 42.13,87.16 35.04,87.16 30.13,82.25 L2.1 29.79,81.67 27.27,79.16 27.27,78.36 C16.2
DCDC_3
  Top 1.143: R11.2 33.85,75.34 34.01,75.19 34.96,75.19 36.07,74.07 36.55,74.07 C15.1 37.02,73.76 37.34,74.07 39.72,74.07 39.88,74.23 L3.1 40.2,74.71 40.2,78.84 42.11,78.84 47.03,83.76 47.03,84.87 C19.1 47.19,85.5 47.03,85.5 45.28,87.25 D1.1
DCDC_4
  Top 1.143: R11.1 33.79,73.79 30.7,73.79 R12.2 30.24,74.02 29.9,74.02 29.79,74.13 27.39,74.13 VR1.5
FET_S_S  (via drill 0.89)
  Top 1.778: v18.93,35.73 14.36,40.3 13.55,40.3 Q3.3 | v25.67,30.81 26.81,30.81 30.02,27.61 Q2.3
  Bottom 1.778: v18.93,35.73 23.84,30.81 v25.67,30.81
GND  (via drill 0.35)
  Top 1.27: C14.2 30.68,67.25 27.34,67.25 VR1.1
  other vias: 1.66,6.6 2.3,7.88 1.66,9.15 1.66,19.3 2.3,20.58 1.66,21.84 2.3,23.12 1.66,24.39 2.3,25.66 1.66,26.93 2.3,28.2 1.66,29.46 2.3,30.73 1.66,32 2.3,33.27 1.66,34.55 2.3,35.81 1.66,37.09 2.3,38.36 1.66,39.62 2.3,40.89 1.66,42.16 2.3,43.44 1.66,44.7 2.3,45.98 1.66,47.24 2.3,48.52 1.66,49.78 2.3,51.05 1.66,52.33 2.3,53.59 1.66,54.87 2.3,56.13 1.66,57.41 2.3,58.67 1.66,59.95 2.3,61.22 1.66,62.48 2.3,63.76 1.66,65.03 2.3,66.3 1.66,67.56 2.3,68.84 1.66,70.11 2.3,71.38 1.66,72.64 2.3,73.91 1.66,75.19 2.3,76.45 1.66,77.72 2.3,79 1.66,80.27 2.3,81.53 1.66,82.81 2.3,84.08 1.66,85.34 2.3,86.61 2.93,6.6 3.57,7.88 2.93,9.15 2.93,19.3 3.57,20.58 2.93,21.84 3.57,23.12 2.93,24.39 3.57,25.66 2.93,26.93 3.57,28.2 2.93,29.46 3.57,30.73 2.93,32 3.57,33.27 2.93,34.55 3.57,35.81 2.93,37.09 3.57,38.36 2.93,39.62 3.57,40.89 2.93,42.16 3.57,43.44 2.93,44.7 3.57,45.98 2.93,47.24 3.57,48.52 2.93,49.78 3.57,51.05 2.93,52.33 3.57,53.59 2.93,54.87 3.57,56.13 2.93,57.41 3.57,58.67 2.93,59.95 3.57,61.22 2.93,62.48 3.57,63.76 2.93,65.03 3.57,66.3 2.93,67.56 3.57,68.84 2.93,70.11 3.57,71.38 2.93,72.64 3.57,73.91 2.93,75.19 3.57,76.45 2.93,77.72 3.57,79 2.93,80.27 3.57,81.53 2.93,82.81 3.57,84.08 2.93,85.34 3.57,86.61 4.2,6.6 4.84,7.88 4.2,9.15 4.84,10.41 4.2,11.69 4.84,12.95 4.2,14.23 4.2,19.3 4.84,20.58 4.2,21.84 4.84,23.12 4.2,24.39 4.2,26.93 4.2,29.46 4.2,32 4.2,34.55 4.2,37.09 4.2,39.62 4.2,42.16 4.84,43.44 4.2,44.7 4.2,85.34 4.84,86.61 6.11,5.34 5.48,6.6 6.11,7.88 5.48,9.15 6.11,10.41 5.48,11.69 6.11,12.95 5.48,14.23 5.48,19.3 6.11,20.58 5.48,21.84 6.11,23.12 5.48,24.39 6.11,79 6.75,1.52 7.38,5.34 6.75,6.6 7.38,7.88 6.75,9.15 7.38,10.41 6.75,11.69 7.38,12.95 6.75,14.23 6.75,19.3 7.38,20.58 6.75,21.84 6.75,47.24 7.38,48.52 6.75,49.78 6.75,57.41 6.75,65.03 8.02,6.6 8.65,7.88 8.02,9.15 8.65,10.41 8.02,11.69 8.65,12.95 8.02,14.23 8.02,19.3 8.65,20.58 8.65,33.27 8.65,35.81 8.65,48.52 8.02,49.78 8.02,54.87 8.65,56.13 8.02,57.41 8.65,58.67 9.92,5.34 9.29,6.6 9.92,7.88 9.29,9.15 9.92,10.41 9.29,11.69 9.92,12.95 9.29,14.23 9.29,19.3 9.92,20.58 9.29,32 9.29,34.55 9.92,35.81 9.29,49.78 9.92,53.59 9.29,54.87 9.92,56.13 9.29,57.41 9.92,58.67 9.92,71.38 9.29,72.64 9.92,73.91 9.92,84.08 9.92,86.61 11.19,5.34 10.55,6.6 11.19,7.88 10.55,9.15 11.19,10.41 10.55,11.69 11.19,12.95 10.55,14.23 10.55,19.3 10.55,24.39 10.55,37.09 11.19,38.36 10.55,52.33 11.19,53.59 10.55,54.87 11.19,56.13 11.19,63.76 10.55,65.03 11.19,66.3 10.55,67.56 11.19,68.84 10.55,70.11 11.19,71.38 10.55,72.64 11.19,73.91 10.55,75.19 11.19,76.45 11.82,6.6 12.46,7.88 11.82,9.15 12.46,10.41 11.82,11.69 12.46,12.95 11.82,14.23 11.82,37.09 12.46,38.36 11.82,39.62 11.82,52.33 12.46,53.59 11.82,54.87 11.82,62.48 11.82,65.03 12.46,66.3 11.82,67.56 12.46,68.84 11.82,70.11 12.46,71.38 11.82,72.64 12.46,73.91 11.82,75.19 12.46,76.45 11.82,77.72 13.1,6.6 13.73,7.88 13.1,9.15 13.73,10.41 13.1,11.69 13.73,12.95 13.1,14.23 13.1,52.33 13.1,59.95 13.1,77.72 13.73,86.61 14.37,1.52 14.37,6.6 15,7.88 14.37,9.15 15,10.41 14.37,11.69 15,12.95 14.37,14.23 15,15.49 14.37,16.77 15,18.03 14.37,19.3 14.37,59.95 14.37,77.72 15,86.61 15.63,1.52 15.63,6.6 15.63,9.15 16.27,10.41 15.63,11.69 16.27,12.95 15.63,14.23 15.63,16.77 16.27,18.03 15.63,19.3 15.63,59.95 16.27,61.22 16.27,63.76 15.63,77.72 16.27,86.61 16.91,1.52 17.54,10.41 16.91,19.3 16.91,59.95 17.54,61.22 16.91,62.48 17.54,63.76 16.91,77.72 17.54,79 17.54,81.53 17.54,84.08 17.54,86.61 18.18,1.52 18.81,2.8 18.18,4.06 18.81,18.03 18.18,59.95 18.81,61.22 18.18,62.48 18.81,63.76 18.18,77.72 18.81,79 18.18,80.27 18.81,81.53 18.18,82.81 18.81,84.08 18.18,85.34 18.81,86.61 19.45,1.52 20.08,2.8 19.45,4.06 19.45,59.95 20.08,61.22 19.45,62.48 20.08,63.76 19.45,77.72 20.08,79 19.45,80.27 20.08,81.53 19.45,82.81 20.08,84.08 19.45,85.34 20.08,86.61 20.71,1.52 21.35,2.8 20.71,4.06 21.35,10.41 20.71,59.95 20.71,62.48 20.71,77.72 21.35,79 20.71,80.27 21.35,81.53 20.71,82.81 21.35,84.08 20.71,85.34 21.35,86.61 21.98,1.52 22.62,2.8 21.98,4.06 22.62,5.34 22.62,10.41 22.62,12.95 22.62,15.49 21.98,16.77 22.62,18.03 21.98,59.95 21.98,77.72 21.98,80.27 21.98,82.81 21.98,85.34 22.62,86.61 23.25,1.52 23.89,2.8 23.25,4.06 23.89,5.34 23.25,6.6 23.89,7.88 23.25,9.15 23.89,10.41 23.25,14.23 23.89,15.49 23.25,16.77 23.89,18.03 23.25,19.3 23.25,59.95 23.89,66.3 23.25,67.56 23.89,68.84 23.89,86.61 24.52,1.52 25.16,2.8 24.52,4.06 25.16,5.34 24.52,6.6 25.16,7.88 24.52,9.15 25.16,10.41 25.16,15.49 24.52,16.77 25.16,18.03 24.52,19.3 24.52,59.95 25.16,61.22 25.16,63.76 24.52,67.56 25.16,86.61 25.8,1.52 26.43,2.8 25.8,4.06 26.43,5.34 25.8,6.6 26.43,7.88 25.8,9.15 26.43,10.41 25.8,14.23 26.43,15.49 25.8,16.77 26.43,18.03 25.8,59.95 26.43,61.22 25.8,62.48 26.43,63.76 25.8,65.03 26.43,86.61 27.07,1.52 27.7,2.8 27.07,4.06 27.7,5.34 27.07,6.6 27.7,7.88 27.07,9.15 27.7,10.41 27.7,12.95 27.07,14.23 27.7,15.49 27.07,59.95 27.7,61.22 27.07,62.48 27.7,63.76 27.07,65.03 27.7,86.61 28.34,1.52 28.97,2.8 28.34,4.06 28.97,5.34 28.34,6.6 28.97,7.88 28.34,9.15 28.97,10.41 28.34,11.69 28.97,12.95 28.34,14.23 28.97,30.73 28.34,59.95 28.97,61.22 28.34,62.48 28.97,63.76 28.34,65.03 28.97,76.45 28.97,86.61 29.61,1.52 30.24,2.8 29.61,4.06 30.24,5.34 29.61,6.6 30.24,7.88 29.61,9.15 30.24,10.41 29.61,11.69 30.24,12.95 30.24,58.67 29.61,59.95 29.61,62.48 29.61,65.03 29.61,77.72 30.24,86.61 30.88,1.52 31.51,2.8 30.88,4.06 31.51,5.34 30.88,6.6 31.51,7.88 30.88,9.15 31.51,10.41 30.88,11.69 31.51,12.95 30.88,19.3 31.51,20.58 30.88,21.84 31.51,23.12 30.88,24.39 31.51,25.66 31.51,28.2 30.88,59.95 30.88,77.72 31.51,86.61 32.14,1.52 32.78,2.8 32.14,4.06 32.78,5.34 32.14,6.6 32.78,7.88 32.14,9.15 32.78,10.41 32.14,16.77 32.78,18.03 32.14,19.3 32.78,20.58 32.14,21.84 32.14,24.39 32.14,26.93 32.14,29.46 32.14,59.95 32.14,75.19 32.14,77.72 32.78,79 32.78,81.53 33.41,1.52 34.05,2.8 33.41,4.06 34.05,5.34 33.41,6.6 34.05,7.88 33.41,9.15 34.05,10.41 34.05,15.49 33.41,16.77 34.05,18.03 34.05,20.58 33.41,21.84 33.41,77.72 34.05,79 33.41,80.27 34.05,81.53 33.41,82.81 34.69,1.52 35.32,2.8 34.69,4.06 35.32,5.34 34.69,6.6 35.32,7.88 34.69,9.15 34.69,14.23 35.32,15.49 34.69,16.77 35.32,18.03 34.69,21.84 35.32,23.12 34.69,77.72 35.32,79 34.69,80.27 35.32,81.53 34.69,82.81 35.32,84.08 35.95,1.52 36.59,2.8 35.95,4.06 36.59,5.34 35.95,6.6 35.95,14.23 36.59,15.49 35.95,16.77 36.59,18.03 36.59,20.58 35.95,21.84 35.95,59.95 36.59,61.22 35.95,62.48 36.59,63.76 35.95,65.03 35.95,77.72 36.59,79 35.95,80.27 36.59,81.53 35.95,82.81 36.59,84.08 35.95,85.34 37.23,1.52 37.86,2.8 37.23,4.06 37.86,5.34 37.23,6.6 37.23,14.23 37.86,15.49 37.23,16.77 37.86,18.03 37.86,20.58 37.23,21.84 37.23,59.95 37.86,61.22 37.23,62.48 37.86,63.76 37.23,65.03 37.23,77.72 37.23,80.27 37.23,82.81 37.23,85.34 38.49,1.52 39.13,2.8 38.49,4.06 39.13,15.49 38.49,16.77 39.13,18.03 38.49,19.3 39.13,20.58 38.49,21.84 39.13,23.12 38.49,24.39 38.49,52.33 39.13,53.59 38.49,59.95 38.49,62.48 38.49,65.03 39.13,66.3 38.49,67.56 39.13,68.84 38.49,75.19 38.49,77.72 39.77,1.52 40.4,2.8 39.77,4.06 40.4,10.41 40.4,12.95 39.77,14.23 40.4,15.49 39.77,16.77 40.4,18.03 39.77,19.3 40.4,20.58 39.77,21.84 40.4,23.12 39.77,24.39 39.77,52.33 40.4,53.59 39.77,59.95 40.4,66.3 39.77,67.56 40.4,68.84 41.03,1.52 41.67,7.88 41.03,9.15 41.67,10.41 41.03,11.69 41.67,12.95 41.03,14.23 41.67,53.59 41.03,59.95 41.67,66.3 41.03,67.56 41.67,68.84 41.03,70.11 41.67,71.38 41.67,76.45 42.3,6.6 42.94,7.88 42.3,9.15 42.94,10.41 42.3,11.69 42.94,12.95 42.3,14.23 42.94,53.59 42.94,56.13 42.94,58.67 42.3,59.95 42.94,61.22 42.94,63.76 42.94,66.3 42.3,67.56 42.94,68.84 42.3,70.11 42.94,71.38 42.94,76.45 42.3,77.72 42.94,84.08 44.21,5.34 43.58,6.6 44.21,7.88 43.58,9.15 44.21,10.41 43.58,11.69 44.21,12.95 43.58,14.23 43.58,52.33 44.21,53.59 43.58,54.87 44.21,56.13 43.58,57.41 44.21,58.67 43.58,59.95 44.21,61.22 43.58,62.48 44.21,63.76 43.58,65.03 44.21,66.3 43.58,67.56 44.21,68.84 43.58,70.11 44.21,71.38 43.58,72.64 44.21,76.45 43.58,77.72 43.58,82.81 44.21,84.08 43.58,85.34 45.48,5.34 44.84,6.6 45.48,7.88 44.84,9.15 45.48,10.41 44.84,11.69 45.48,12.95 44.84,14.23 44.84,19.3 45.48,20.58 44.84,21.84 44.84,24.39 44.84,52.33 45.48,53.59 44.84,54.87 45.48,56.13 44.84,57.41 45.48,58.67 44.84,59.95 45.48,61.22 44.84,62.48 45.48,63.76 44.84,65.03 45.48,66.3 44.84,67.56 45.48,68.84 44.84,70.11 45.48,71.38 44.84,72.64 45.48,73.91 44.84,75.19 44.84,77.72 44.84,85.34 46.11,6.6 46.75,7.88 46.11,9.15 46.75,10.41 46.11,11.69 46.75,12.95 46.11,14.23 46.11,19.3 46.75,20.58 46.11,21.84 46.75,33.27 46.11,52.33 46.75,53.59 46.11,54.87 46.75,56.13 46.11,57.41 46.75,58.67 46.11,59.95 46.11,62.48 46.11,65.03 46.75,66.3 46.11,67.56 46.75,68.84 46.11,70.11 46.75,71.38 46.11,72.64 48.02,5.34 47.39,6.6 48.02,7.88 47.39,9.15 48.02,10.41 47.39,11.69 48.02,12.95 47.39,14.23 47.39,19.3 48.02,20.58 47.39,21.84 48.02,23.12 48.02,48.52 47.39,57.41 48.02,58.67 47.39,65.03 47.39,67.56 47.39,70.11 48.02,76.45 48.66,4.06 49.29,5.34 48.66,6.6 49.29,7.88 48.66,9.15 49.29,10.41 48.66,11.69 49.29,12.95 48.66,14.23 48.66,19.3 49.29,20.58 48.66,21.84 49.29,23.12 48.66,24.39 49.29,25.66 49.29,48.52 48.66,49.78 48.66,57.41 49.29,58.67 48.66,65.03 49.29,76.45 49.29,79 49.29,81.53 49.29,84.08 49.92,6.6 50.56,7.88 49.92,9.15 50.56,10.41 49.92,11.69 50.56,12.95 49.92,14.23 49.92,19.3 50.56,20.58 49.92,21.84 50.56,23.12 49.92,24.39 50.56,25.66 49.92,26.93 50.56,43.44 49.92,44.7 50.56,48.52 49.92,49.78 50.56,51.05 50.56,53.59 50.56,56.13 49.92,57.41 50.56,58.67 50.56,76.45 49.92,77.72 50.56,79 49.92,80.27 50.56,81.53 49.92,82.81 51.2,6.6 51.83,7.88 51.2,9.15 51.2,19.3 51.83,20.58 51.2,21.84 51.83,23.12 51.2,24.39 51.83,25.66 51.2,26.93 51.83,28.2 51.2,29.46 51.83,30.73 51.2,32 51.83,33.27 51.2,34.55 51.83,35.81 51.2,37.09 51.83,38.36 51.2,39.62 51.83,40.89 51.2,42.16 51.83,43.44 51.2,44.7 51.83,45.98 51.2,47.24 51.83,86.61 52.47,6.6 53.1,7.88 52.47,9.15 52.47,19.3 53.1,20.58 52.47,21.84 53.1,23.12 52.47,24.39 53.1,25.66 52.47,26.93 53.1,28.2 52.47,29.46 53.1,30.73 52.47,32 53.1,33.27 52.47,34.55 53.1,35.81 52.47,37.09 53.1,38.36 52.47,39.62 53.1,40.89 52.47,42.16 53.1,43.44 52.47,44.7 53.1,45.98 52.47,47.24 53.1,48.52 53.1,51.05 53.1,53.59 53.1,56.13 53.1,58.67 53.1,61.22 53.1,63.76 53.1,66.3 53.1,68.84 53.1,71.38 53.1,76.45 53.1,79 52.47,80.27 53.1,81.53 53.1,84.08 53.1,86.61 53.73,6.6 53.73,9.15 53.73,11.69 53.73,14.23 53.73,19.3 53.73,21.84 53.73,24.39 53.73,26.93 53.73,29.46 53.73,32 53.73,34.55 53.73,37.09 53.73,39.62 53.73,42.16 53.73,44.7 53.73,47.24 53.73,49.78 53.73,52.33 53.73,54.87 53.73,57.41 53.73,59.95 53.73,62.48 53.73,65.03 53.73,67.56 53.73,70.11 53.73,72.64 53.73,75.19 53.73,77.72 53.73,80.27 53.73,82.81 53.73,85.34
  pour Bottom: -0.44,89.16 -0.44,-0.38 55.44,-0.38 55.44,89.16
  pour Top: -0.44,89.16 -0.44,-0.38 55.44,-0.38 55.44,89.16
HOLE2  (via drill 3.2 pad 5.5)
  other vias: 52,3
HOLE3  (via drill 3.2 pad 5.5)
  other vias: 3,108
HOLE4  (via drill 3.2 pad 5.5)
  other vias: 3,3
LED1
  Top 0.254: LED1.A 52.3,12.52 52.3,15.84 R2.1
LED2
  Top 0.254: LED2.A 2.7,12.52 2.7,15.84 R3.1
LED3
  Top 0.254: LED3.A 50.82,74.25 49.33,74.25 R13.1
N$1  (via drill 0.3)
  Top 0.508: IC1.5 17.9,21.78 17.44,21.78 16.98,21.32 16.98,20.41 17.44,19.95 22.47,19.95 24.87,22.35 24.87,27.5 Q2.1 24.76,27.73 24.3,28.18 24.3,31.27 24.41,31.38 v24.41,32.3 | v21.56,35.16 18.7,38.01 18.7,40.3 Q3.1
  Bottom 0.508: v24.41,32.3 v21.56,35.16
N$2
  Top 0.508: R4.1 41.56,49.44 43.96,49.44 C20.2 44.19,49.56 45.45,49.56 | 45.45,49.56 46.25,49.56 48.42,51.73 XH_SW_PWR.2 | 45.45,49.56 45.45,47.16 44.3,46.01 42.82,46.01 Q4.1
N$3  (via drill 3.2 pad 5.5)
  other vias: 52,108
N$11
  Top 0.508: R5.1 13.44,49.44 12.18,50.7 Q5.1 12.18,51.04 11.04,49.9 11.04,49.44 C21.2 10.81,49.9 6.58,54.13 XH_SW_SRV.2
N$21
  Top 0.254: C5.1 19.27,107.73 23.16,107.73 Y1.1 23.27,107.62 23.27,105.68 24.76,104.19 25.67,104.19 IC2.2
N$22  (via drill 0.3)
  Top 0.254: v11.04,105.79 11.04,108.19 FL1.1
  Bottom 0.254: v11.04,105.79 11.04,103.62 11.16,103.51 11.16,103.28 11.38,103.05 11.38,102.02 USB1.1
N$23
  Top 0.254: 26.93,109.34 25.44,109.34 Y1.3 | 26.93,109.34 28.76,109.34 C6.1 | 26.93,109.34 26.93,103.73 26.7,103.51 25.79,103.51 IC2.3
N$29  (via drill 0.3)
  Top 0.254: v28.07,96.42 IC2.15
  Bottom 0.254: v28.07,96.42 25.73,98.76 14.08,98.76 12.07,100.76 12.07,101.91 USB1.2
N$30  (via drill 0.3)
  Top 0.254: v27.04,98.93 27.16,99.05 28.3,99.05 28.76,98.59 28.76,97.91 29.56,97.1 31.16,97.1 IC2.16
  Bottom 0.254: v27.04,98.93 26.76,99.21 14.42,99.21 12.87,100.76 12.87,101.91 USB1.3
N$31
  Top 0.254: R10.2 23.16,94.13 23.38,94.13 25.67,96.42 IC2.14
POWER_SW1  (via drill 0.3)
  Top 0.508: IC1.4 18.01,20.98 R1.1 22.01,21.1 22.36,21.44 22.47,21.44 24.07,23.04 v24.07,23.84 | v37.44,37.21 38.36,37.21 41.45,40.3 Q1.1
  Bottom 0.508: v37.44,37.21 v24.07,23.84
RS485_1
  Top 0.254: R9.2 17.78,93.33 15.16,95.96 11.73,95.96 IC3.14
RS485_2
  Top 0.254: IC4.3 8.64,99.28 8.64,98.13 IC4.2 8.75,98.25 10.24,96.76 11.61,96.76 IC3.13
RS485_3V3  (via drill 0.3)
  Top 0.254: 3.38,95.96 3.38,96.65 3.27,96.76 IC4.8 | 3.38,95.96 3.38,93.33 C4.1 | R8.2 14.7,93.33 16.07,93.33 R9.1 15.84,93.45 v15.84,94.36 | v17.1,95.62 17.1,96.76 17.67,97.33 18.59,97.33 IC3.17 | v10.24,99.85 10.24,102.13 10.58,102.48 11.61,102.48 IC3.4 | v6.13,95.96 3.38,95.96
  Bottom 0.254: v17.1,95.62 v15.84,94.36 15.73,94.36 v10.24,99.85 10.01,99.85 v6.13,95.96
RS485_D+
  Top 0.254: 47.45,44.47 47.27,44.64 46.13,44.64 45.22,43.73 45.22,42.13 46.47,40.87 XH_SRV_1.3 | 47.45,44.47 49.79,42.13 49.79,28.98 48.07,27.27 47.96,27.27 46.59,25.9 XH_SRV_2.3 | R7.2 11.61,93.33 12.98,93.33 R8.1 | IC4.6 3.27,99.28 4.53,99.28 9.55,94.25 10.58,94.25 11.5,93.33 R7.2 | XH_SRV_4.3 8.53,28.18 8.53,27.5 9.78,26.24 9.78,25.21 8.98,24.41 7.61,24.41 5.21,26.81 5.21,40.07 8.41,43.27 XH_SRV_3.3 8.41,43.38 5.21,46.59 5.21,76.99 11.5,83.28 11.5,90.59 | 11.5,90.59 11.5,93.22 R7.2 | 47.45,44.47 51.62,48.64 51.62,84.53 45.62,90.59 11.5,90.59
RS485_D-  (via drill 0.3)
  Top 0.254: v45.22,34.24 45.22,25.44 46.47,24.18 46.47,23.38 XH_SRV_2.4 | R6.2 8.41,93.33 9.78,93.33 R7.1 | IC4.7 3.27,98.02 4.98,98.02 8.41,94.59 8.41,93.45 R6.2 | v7.04,43.84 4.75,46.13 4.75,83.62 8.3,87.16 8.3,93.22 R6.2 | XH_SRV_1.4 46.47,38.36 42.13,42.7 27.96,42.7 27.27,43.38 27.27,54.01 27.04,54.24 17.78,54.24 16.53,52.98 16.53,47.38 13.78,44.64 9.55,44.64 8.53,45.67 XH_SRV_3.4
  Bottom 0.254: v45.22,34.24 45.22,36.07 46.13,36.98 46.13,37.33 46.47,37.67 46.47,38.24 XH_SRV_1.4 | 7.21,43.67 8.41,44.87 8.41,45.67 XH_SRV_3.4 | 7.21,43.67 5.67,42.13 5.67,33.44 8.41,30.7 XH_SRV_4.4 | 7.21,43.67 v7.04,43.84
RXD
  Top 0.254: IC4.1 8.53,96.88 8.18,96.88 7.5,97.56 7.5,102.02 10.58,105.11 12.64,105.11 12.87,104.88 12.87,102.25 12.53,101.91 11.73,101.91 IC3.5
TXD
  Top 0.254: IC4.4 8.64,100.65 8.64,102.48 10.58,104.42 11.61,104.42 IC3.1
USB-HUB_1_D+
  Top 0.254: IC2.11 25.67,98.36 24.87,98.36 23.5,96.99 23.5,96.65 22.93,96.08 18.7,96.08 IC3.15
USB-HUB_1_D-
  Top 0.254: IC2.10 25.67,98.93 24.76,98.93 23.04,97.22 23.04,96.88 22.7,96.53 19.73,96.53 19.61,96.65 18.7,96.65 IC3.16
USB-HUB_2_D+
  Top 0.254: IC2.9 25.79,99.62 27.73,99.62 28.76,100.65 28.76,104.87 31.04,107.15 31.04,108.75 31.39,109.09 32.53,109.09 39.39,102.24 39.39,95.96 40.42,94.93 USB2.A3
USB-HUB_2_D-  (via drill 0.3)
  Top 0.254: v27.84,100.65 27.5,100.31 25.79,100.31 IC2.8 | v32.53,98.59 33.44,98.59 35.39,96.65 37.22,96.65 37.9,95.96 38.47,95.96 39.39,95.05 39.39,94.36 40.07,93.68 41.22,93.68 42.36,94.82 USB2.A2
  Bottom 0.254: v27.84,100.65 30.47,100.65 v32.53,98.59
USB-HUB_3_D+
  Top 0.254: IC2.7 25.67,100.99 24.76,100.99 23.04,102.71 23.04,103.62 21.56,105.11 17.67,105.11 16.41,103.85 16.41,95.39 17.56,94.25 19.61,94.25 22.81,91.05 40.3,91.05 43.62,94.36 43.62,95.28 42.59,96.31 41.67,96.31 40.53,97.45 USB2.B3
USB-HUB_3_D-  (via drill 0.3)
  Top 0.254: v28.07,101.56 25.79,101.56 IC2.6
  Bottom 0.254: v28.07,101.56 32.53,101.56 33.79,102.82 37.44,102.82 42.36,97.91 42.36,97.56 USB2.B2
V+  (via drill 0.89)
  Top 0.762: IC1.6 21.79,22.8
  Top 1.778: C20.1 43.96,47.61 41.56,47.61 R4.2 40.64,47.73 40.42,47.73 | 40.42,47.73 39.73,48.41 39.73,50.24 40.53,51.04 42.7,51.04 Q4.3 | v39.73,43.96 39.73,46.7 39.84,46.81 39.84,47.16 40.42,47.73 | v38.02,41.44 37.22,40.64 Q1.3 36.3,40.3 30.24,40.3 28.19,38.24 Q2.4 27.5,37.67 22.93,33.1 22.93,25.44 21.79,24.3 R1.2 21.79,22.8
  Bottom 1.778: v39.73,43.96 39.73,43.16 v38.02,41.44
VCC  (via drill 0.89)
  Top 1.778: 48.53,35.73 48.53,41.55 46.82,43.27 46.59,43.27 XH_SRV_1.2 | 48.53,35.73 48.53,29.55 47.39,28.41 46.59,28.41 XH_SRV_2.2 | XH_SRV_4.2 8.41,25.78 8.07,25.78 6.47,27.38 6.47,39.5 7.61,40.64 8.41,40.64 XH_SRV_3.2 9.21,41.1 10.36,41.1 12.64,43.38 17.33,43.38 22.36,48.41 Q5.4 19.04,43.96 v20.98,42.01 | v34.02,35.73 48.53,35.73
  Bottom 1.778: v34.02,35.73 27.73,42.01 v20.98,42.01
VD18  (via drill 0.3)
  Top 0.254: 27.04,97.33 26.7,97.68 25.79,97.68 IC2.12 | 27.04,97.33 27.39,96.99 27.39,95.5 26.93,95.05 26.93,94.13 C9.1 | v28.99,99.28 29.21,99.5 29.21,103.62 30.36,104.76 31.16,104.76 IC2.28 | 27.04,97.33 v28.07,98.36
  Bottom 0.254: v28.07,98.36 v28.99,99.28
VD33
  Top 0.254: 32.07,103.51 32.3,103.73 32.3,105.11 31.96,105.45 31.96,106.35 C8.1 | 32.07,103.51 31.27,103.51 IC2.26 | IC2.13 25.79,96.99 26.7,96.99 26.93,96.76 26.93,95.73 26.01,94.82 26.01,91.73 26.24,91.5 31.04,91.5 32.3,92.76 32.3,97.45 32.07,97.68 31.27,97.68 IC2.17 31.16,97.79 31.16,98.25 IC2.18 31.16,98.36 31.16,98.93 IC2.19 31.27,99.05 32.07,99.05 32.3,99.28 32.3,99.96 32.07,100.19 | 32.07,100.19 31.27,100.19 IC2.21 | 32.07,103.51 32.07,103.39 32.3,103.16 32.3,100.53 32.07,100.31 32.07,100.19
VDD
  Top 1.778: 6.58,70.7 6.58,74.93 7.73,76.07 C18.1 8.53,76.53 14.13,82.13 14.81,82.13 L1.2 | 6.58,70.7 XH_FAN.2 | 30.02,69.1 27.39,69.1 VR1.2 | 30.02,69.1 30.59,69.1 C14.1 31.67,69.05 33.67,67.04 33.67,66.13 34.13,65.67 34.13,56.53 | 30.02,69.1 30.02,71.73 29.33,72.42 27.39,72.42 VR1.4 | 12.18,46.01 11.04,47.16 11.04,47.61 C21.1 | 12.18,46.01 Q5.3 | 12.18,46.01 12.76,46.7 13.44,47.38 13.44,47.61 R5.2 14.36,47.73 14.58,47.73 15.27,48.41 15.27,56.53 | 8.41,62.36 6.58,62.36 XH_METER.2 | 8.41,62.36 14.13,56.64 C13.1 15.04,56.53 15.27,56.53 | 15.27,56.53 23.04,56.53 C12.1 23.84,56.53 31.84,56.53 C11.1 | 34.13,56.53 32.76,56.53 C11.1 | 34.13,56.53 40.76,56.53 C10.1 | Q4.4 32.64,48.53 32.64,55.73 C11.1 | 6.58,70.7 7.38,70.36 7.61,70.36 8.53,69.44 8.53,63.16 8.41,62.36

### Text on the board
tPlace: + | - | + | - | - | + | - | - | + | + | - | - | D+ | D+ | D- | D- | + | + | - | - | D+ | D+ | D- | D-
bPlace: CIT Brains / GankenKun MainBoard ver2.0 / / Designed by Masato Kubotera / on August 8, 2021. | Check lists / [ ] No Short Circuit / [ ] Two power switching / [ ] ON/OFF switching / [ ] Buck-Boost Converter / [ ] USB-HUB / [ ] USB-RS485